# Altium schematic sheet Registers_Module.SchDoc
size A1; SheetNumber: 3; SheetTotal: 9
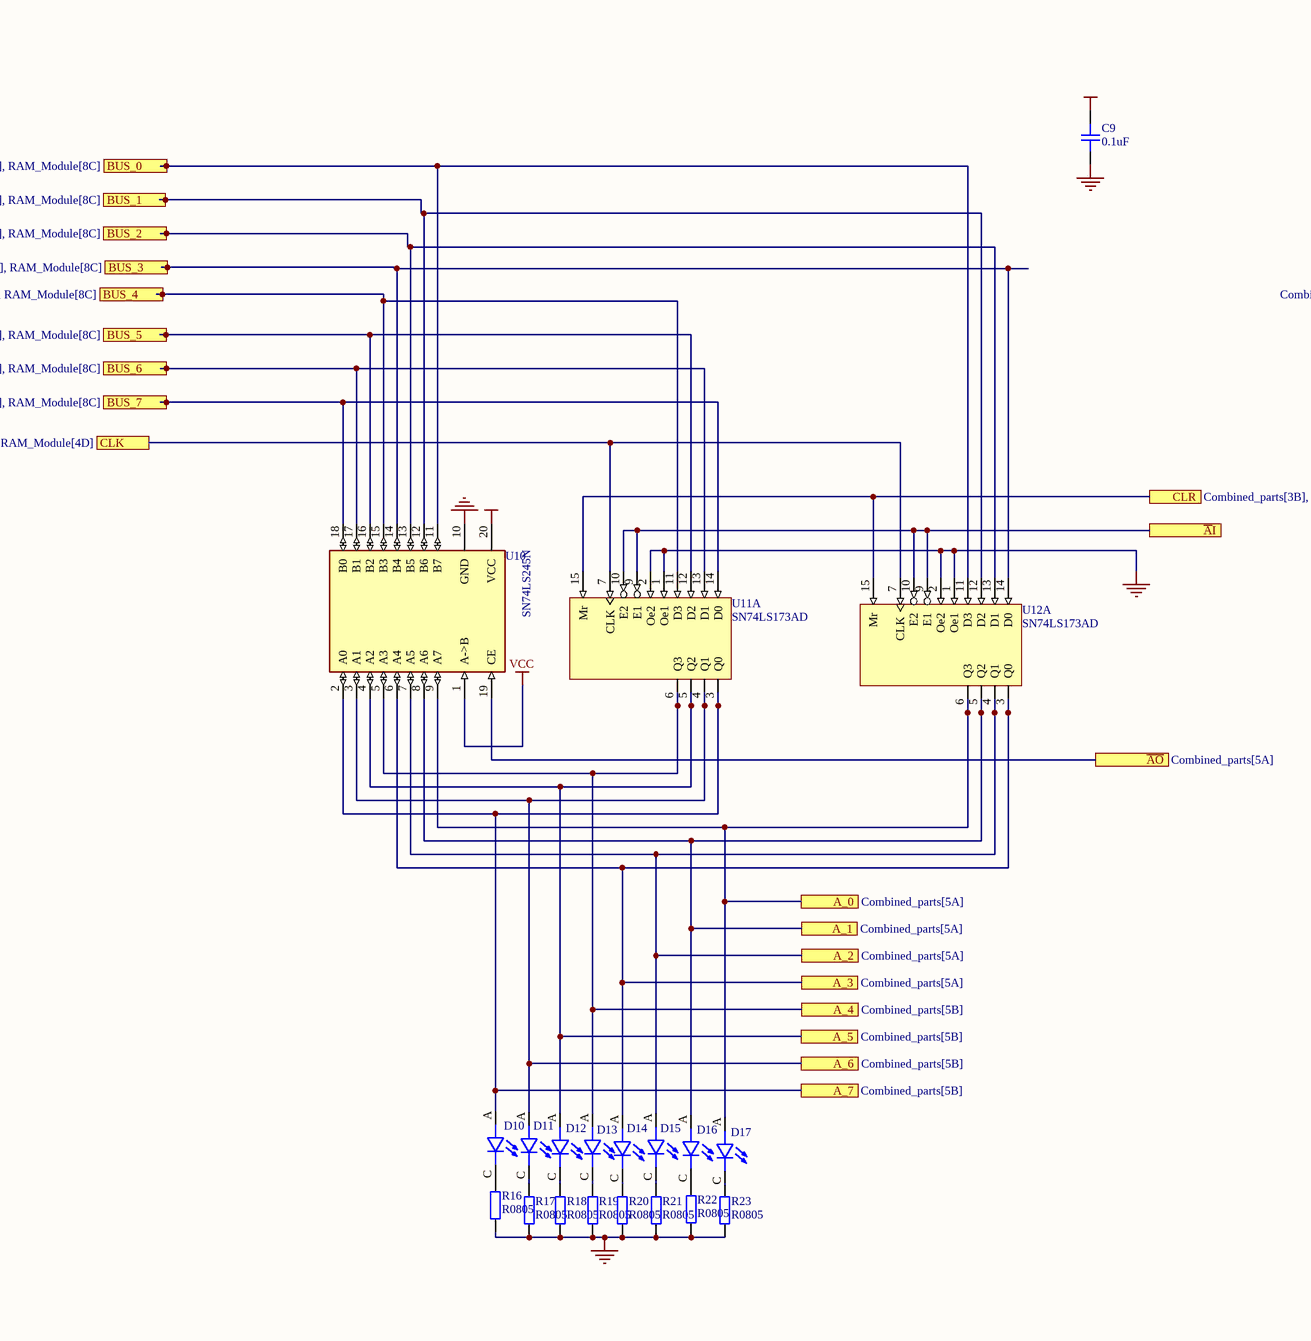
[diagram p0: Registers_Module.SchDoc, top left]
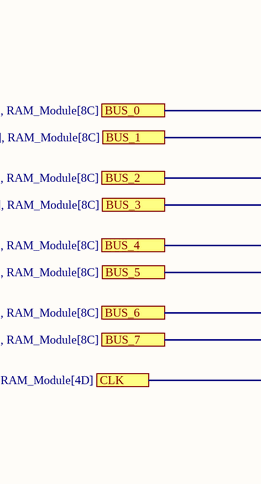
[diagram p1: Registers_Module.SchDoc, top middle]
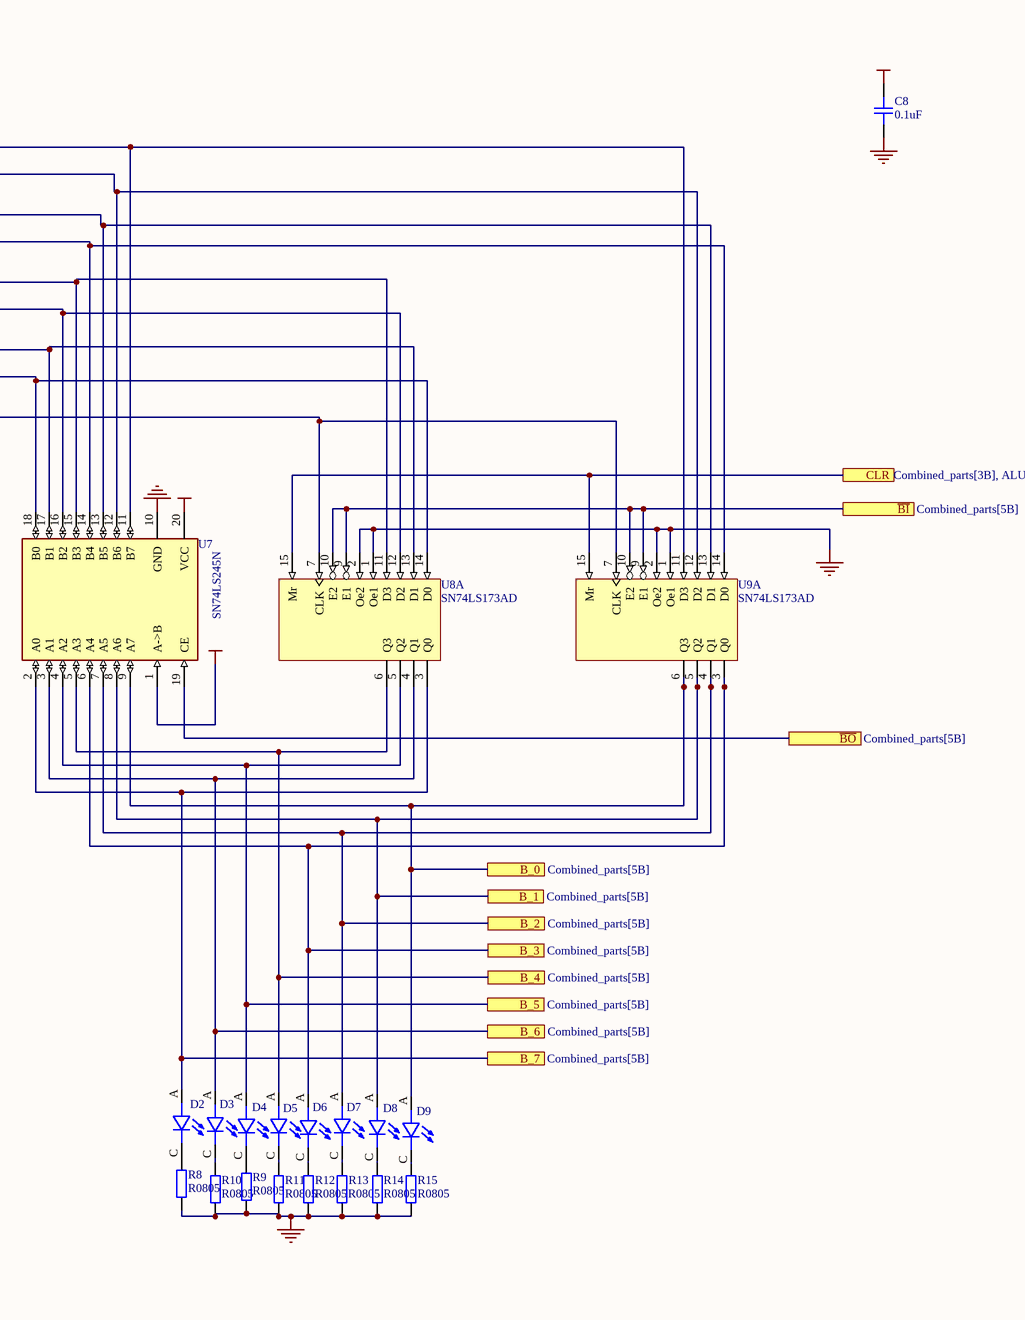
[diagram p2: Registers_Module.SchDoc, top right]
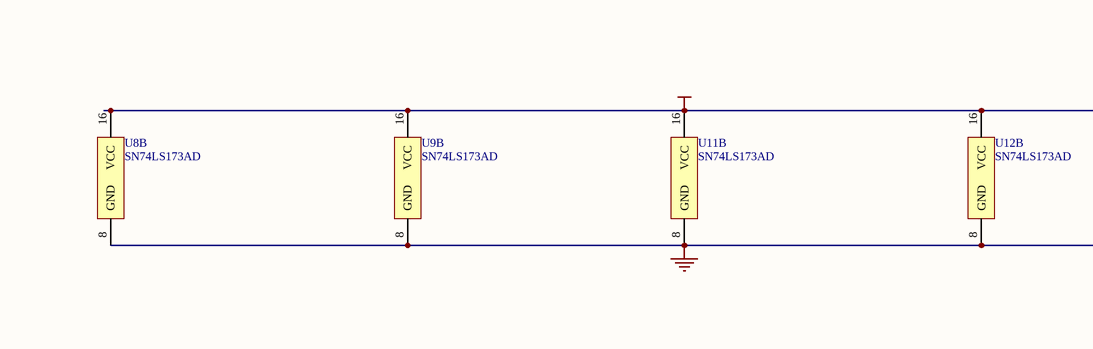
[diagram p3: Registers_Module.SchDoc, bottom left]
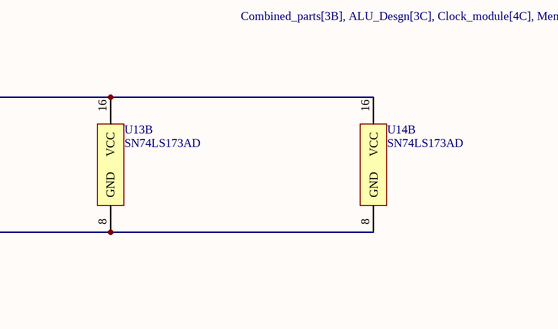
[diagram p4: Registers_Module.SchDoc, bottom middle]
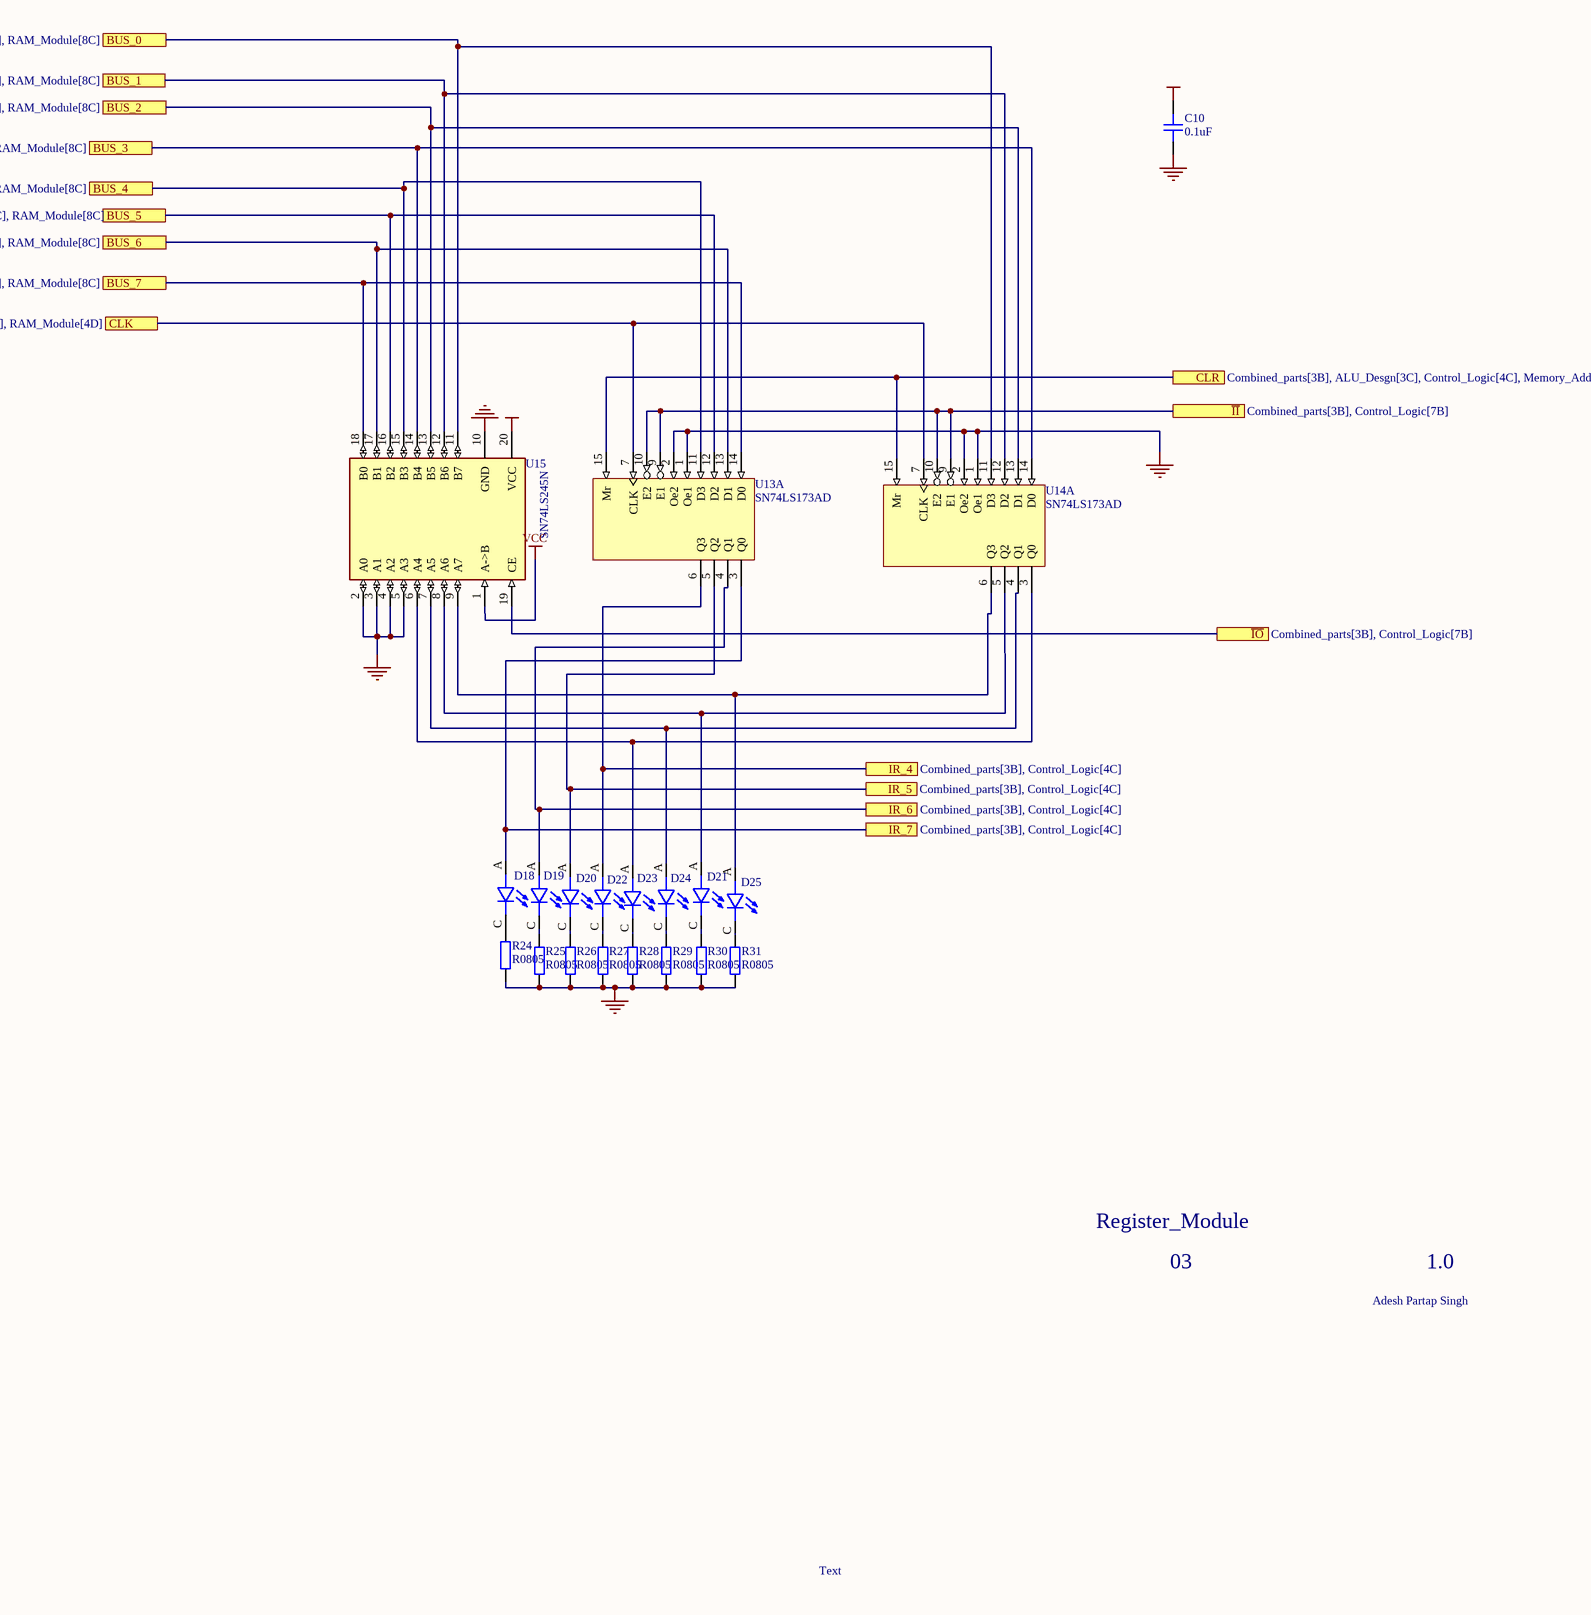
[diagram p5: Registers_Module.SchDoc, bottom right]

## Parts
C8  0.1uF  [CAP_0805]
C9  0.1uF  [CAP_0805]
C10  0.1uF  [CAP_0805]
D2  L08R5000Q1  [LEDRD254W57D500H1070]  (value not drawn)
D3  L08R5000Q1  [LEDRD254W57D500H1070]  (value not drawn)
D4  L08R5000Q1  [LEDRD254W57D500H1070]  (value not drawn)
D5  L08R5000Q1  [LEDRD254W57D500H1070]  (value not drawn)
D6  L08R5000Q1  [LEDRD254W57D500H1070]  (value not drawn)
D7  L08R5000Q1  [LEDRD254W57D500H1070]  (value not drawn)
D8  L08R5000Q1  [LEDRD254W57D500H1070]  (value not drawn)
D9  L08R5000Q1  [LEDRD254W57D500H1070]  (value not drawn)
D10  L08R5000Q1  [LEDRD254W57D500H1070]  (value not drawn)
D11  L08R5000Q1  [LEDRD254W57D500H1070]  (value not drawn)
D12  L08R5000Q1  [LEDRD254W57D500H1070]  (value not drawn)
D13  L08R5000Q1  [LEDRD254W57D500H1070]  (value not drawn)
D14  L08R5000Q1  [LEDRD254W57D500H1070]  (value not drawn)
D15  L08R5000Q1  [LEDRD254W57D500H1070]  (value not drawn)
D16  L08R5000Q1  [LEDRD254W57D500H1070]  (value not drawn)
D17  L08R5000Q1  [LEDRD254W57D500H1070]  (value not drawn)
D18  L08R5000Q1  [LEDRD254W57D500H1070]  (value not drawn)
D19  L08R5000Q1  [LEDRD254W57D500H1070]  (value not drawn)
D20  L08R5000Q1  [LEDRD254W57D500H1070]  (value not drawn)
D21  L08R5000Q1  [LEDRD254W57D500H1070]  (value not drawn)
D22  L08R5000Q1  [LEDRD254W57D500H1070]  (value not drawn)
D23  L08R5000Q1  [LEDRD254W57D500H1070]  (value not drawn)
D24  L08R5000Q1  [LEDRD254W57D500H1070]  (value not drawn)
D25  L08R5000Q1  [LEDRD254W57D500H1070]  (value not drawn)
R8  R0805  [RES_0805]
R9  R0805  [RES_0805]
R10  R0805  [RES_0805]
R11  R0805  [RES_0805]
R12  R0805  [RES_0805]
R13  R0805  [RES_0805]
R14  R0805  [RES_0805]
R15  R0805  [RES_0805]
R16  R0805  [RES_0805]
R17  R0805  [RES_0805]
R18  R0805  [RES_0805]
R19  R0805  [RES_0805]
R20  R0805  [RES_0805]
R21  R0805  [RES_0805]
R22  R0805  [RES_0805]
R23  R0805  [RES_0805]
R24  R0805  [RES_0805]
R25  R0805  [RES_0805]
R26  R0805  [RES_0805]
R27  R0805  [RES_0805]
R28  R0805  [RES_0805]
R29  R0805  [RES_0805]
R30  R0805  [RES_0805]
R31  R0805  [RES_0805]
U7  SN74LS245N  [FP-N0020A-MFG]
U8  SN74LS173AD  [D0016A_N]  (parts A,B of 2)
U9  SN74LS173AD  [D0016A_N]  (parts A,B of 2)
U10  SN74LS245N  [FP-N0020A-MFG]
U11  SN74LS173AD  [D0016A_N]  (parts A,B of 2)
U12  SN74LS173AD  [D0016A_N]  (parts A,B of 2)
U13  SN74LS173AD  [D0016A_N]  (parts A,B of 2)
U14  SN74LS173AD  [D0016A_N]  (parts A,B of 2)
U15  SN74LS245N  [FP-N0020A-MFG]

## Ports
A_0 (see Combined_parts[5A]), A_1 (see Combined_parts[5A]), A_2 (see Combined_parts[5A]), A_3 (see Combined_parts[5A]), A_4 (see Combined_parts[5B]), A_5 (see Combined_parts[5B]), A_6 (see Combined_parts[5B]), A_7 (see Combined_parts[5B]), B_0 (see Combined_parts[5B]), B_1 (see Combined_parts[5B]), B_2 (see Combined_parts[5B]), B_3 (see Combined_parts[5B]), B_4 (see Combined_parts[5B]), B_5 (see Combined_parts[5B]), B_6 (see Combined_parts[5B]), B_7 (see Combined_parts[5B]), BUS_0 (see Combined_parts[3B], ALU_Desgn[4A], Memory_Add_Register[4A], Output_Registers[3C], Program_Counter[3C], RAM_Module[8C]), BUS_1 (see Combined_parts[3B], ALU_Desgn[4A], Memory_Add_Register[4A], Output_Registers[3C], Program_Counter[3C], RAM_Module[8C]), BUS_2 (see Combined_parts[3B], ALU_Desgn[4B], Memory_Add_Register[4A], Output_Registers[3C], Program_Counter[3C], RAM_Module[8C]), BUS_3 (see Combined_parts[3B], ALU_Desgn[4B], Memory_Add_Register[4B], Output_Registers[3C], Program_Counter[3C], RAM_Module[8C]), BUS_4 (see Combined_parts[3B], ALU_Desgn[4B], Output_Registers[3C], RAM_Module[8C]), BUS_5 (see Combined_parts[3B], ALU_Desgn[4B], Output_Registers[3C], RAM_Module[8C]), BUS_6 (see Combined_parts[3B], ALU_Desgn[4B], Output_Registers[3C], RAM_Module[8C]), BUS_7 (see Combined_parts[3B], ALU_Desgn[4B], Output_Registers[3C], RAM_Module[8C]), CLK (see Combined_parts[3B], ALU_Desgn[3C], Clock_module[4C], Memory_Add_Register[3A], Output_Registers[3C], Program_Counter[3C], RAM_Module[4D]), CLR (see Combined_parts[3B], ALU_Desgn[3C], Control_Logic[4C], Memory_Add_Register[3A]), IR_4 (see Combined_parts[3B], Control_Logic[4C]), IR_5 (see Combined_parts[3B], Control_Logic[4C]), IR_6 (see Combined_parts[3B], Control_Logic[4C]), IR_7 (see Combined_parts[3B], Control_Logic[4C]), ~{AO} (see Combined_parts[5A]), ~{A}I, ~{BI} (see Combined_parts[5B]), ~{BO} (see Combined_parts[5B]), ~{II} (see Combined_parts[3B], Control_Logic[7B]), ~{IO} (see Combined_parts[3B], Control_Logic[7B])

## Nets
GND: C8.1 C9.1 C10.1 R8.1 R9.1 R10.1 R11.1 R12.1 R13.1 R14.1 R15.1 R16.1 R17.1 R18.1 R19.1 R20.1 R21.1 R22.1 R23.1 R24.1 R25.1 R26.1 R27.1 R28.1 R29.1 R30.1 R31.1 U7.10(GND) U8.1(Oe1) U8.2(Oe2) U8.8(GND) U9.1(Oe1) U9.2(Oe2) U9.8(GND) U10.10(GND) U11.1(Oe1) U11.2(Oe2) U11.8(GND) U12.1(Oe1) U12.2(Oe2) U12.8(GND) U13.1(Oe1) U13.2(Oe2) U13.8(GND) U14.1(Oe1) U14.2(Oe2) U14.8(GND) U15.2(A0) U15.3(A1) U15.4(A2) U15.5(A3) U15.10(GND)
VCC: C8.2 C9.2 C10.2 U7.1(A->B) U7.20(VCC) U8.16(VCC) U9.16(VCC) U10.1(A->B) U10.20(VCC) U11.16(VCC) U12.16(VCC) U13.16(VCC) U14.16(VCC) U15.1(A->B) U15.20(VCC)
~{A}I: U11.9(E1) U11.10(E2) U12.9(E1) U12.10(E2) ; port ~{A}I
~{AO}: U10.19(CE) ; port ~{AO}
A_0: D17.A U10.9(A7) U12.6(Q3) ; port A_0
A_1: D16.A U10.8(A6) U12.5(Q2) ; port A_1
A_2: D15.A U10.7(A5) U12.4(Q1) ; port A_2
A_3: D14.A U10.6(A4) U12.3(Q0) ; port A_3
A_4: D13.A U10.5(A3) U11.6(Q3) ; port A_4
A_5: D12.A U10.4(A2) U11.5(Q2) ; port A_5
A_6: D11.A U10.3(A1) U11.4(Q1) ; port A_6
A_7: D10.A U10.2(A0) U11.3(Q0) ; port A_7
~{BI}: U8.9(E1) U8.10(E2) U9.9(E1) U9.10(E2) ; port ~{BI}
~{BO}: U7.19(CE) ; port ~{BO}
B_0: D9.A U7.9(A7) U9.6(Q3) ; port B_0
B_1: D8.A U7.8(A6) U9.5(Q2) ; port B_1
B_2: D7.A U7.7(A5) U9.4(Q1) ; port B_2
B_3: D6.A U7.6(A4) U9.3(Q0) ; port B_3
B_4: D5.A U7.5(A3) U8.6(Q3) ; port B_4
B_5: D4.A U7.4(A2) U8.5(Q2) ; port B_5
B_6: D3.A U7.3(A1) U8.4(Q1) ; port B_6
B_7: D2.A U7.2(A0) U8.3(Q0) ; port B_7
BUS_0: U7.11(B7) U9.11(D3) U10.11(B7) U12.11(D3) U14.11(D3) U15.11(B7) ; port BUS_0
BUS_1: U7.12(B6) U9.12(D2) U10.12(B6) U12.12(D2) U14.12(D2) U15.12(B6) ; port BUS_1
BUS_2: U7.13(B5) U9.13(D1) U10.13(B5) U12.13(D1) U14.13(D1) U15.13(B5) ; port BUS_2
BUS_3: U7.14(B4) U9.14(D0) U10.14(B4) U12.14(D0) U14.14(D0) U15.14(B4) ; port BUS_3
BUS_4: U7.15(B3) U8.11(D3) U10.15(B3) U11.11(D3) U13.11(D3) U15.15(B3) ; port BUS_4
BUS_5: U7.16(B2) U8.12(D2) U10.16(B2) U11.12(D2) U13.12(D2) U15.16(B2) ; port BUS_5
BUS_6: U7.17(B1) U8.13(D1) U10.17(B1) U11.13(D1) U13.13(D1) U15.17(B1) ; port BUS_6
BUS_7: U7.18(B0) U8.14(D0) U10.18(B0) U11.14(D0) U13.14(D0) U15.18(B0) ; port BUS_7
CLK: U8.7(CLK) U9.7(CLK) U11.7(CLK) U12.7(CLK) U13.7(CLK) U14.7(CLK) ; port CLK
CLR: U8.15(Mr) U9.15(Mr) U11.15(Mr) U12.15(Mr) U13.15(Mr) U14.15(Mr) ; port CLR
~{II}: U13.9(E1) U13.10(E2) U14.9(E1) U14.10(E2) ; port ~{II}
~{IO}: U15.19(CE) ; port ~{IO}
IR_4: D22.A U13.6(Q3) ; port IR_4
IR_5: D20.A U13.5(Q2) ; port IR_5
IR_6: D19.A U13.4(Q1) ; port IR_6
IR_7: D18.A U13.3(Q0) ; port IR_7
NetD2_C: D2.C R8.2
NetD3_C: D3.C R10.2
NetD4_C: D4.C R9.2
NetD5_C: D5.C R11.2
NetD6_C: D6.C R12.2
NetD7_C: D7.C R13.2
NetD8_C: D8.C R14.2
NetD9_C: D9.C R15.2
NetD10_C: D10.C R16.2
NetD11_C: D11.C R17.2
NetD12_C: D12.C R18.2
NetD13_C: D13.C R19.2
NetD14_C: D14.C R20.2
NetD15_C: D15.C R21.2
NetD16_C: D16.C R22.2
NetD17_C: D17.C R23.2
NetD18_C: D18.C R24.2
NetD19_C: D19.C R25.2
NetD20_C: D20.C R26.2
NetD21_A: D21.A U14.5(Q2) U15.8(A6)
NetD21_C: D21.C R30.2
NetD22_C: D22.C R27.2
NetD23_A: D23.A U14.3(Q0) U15.6(A4)
NetD23_C: D23.C R28.2
NetD24_A: D24.A U14.4(Q1) U15.7(A5)
NetD24_C: D24.C R29.2
NetD25_A: D25.A U14.6(Q3) U15.9(A7)
NetD25_C: D25.C R31.2

## Notes on the sheet
- Register_Module
- 03
- Adesh Partap Singh
- 1.0
- Text

## Library data of the parts
C8-C10 = CAP_0805: Capacitor SMD 0805; Manufacturer: *; Manufacturer Part Number: *; Distributor Link: *; LCSC: *; Rating: *; Dielectric: *
D2-D25 = L08R5000Q1: LED, 5MM, ORANGE; LED / Lamp Size: 5mm / T-1 3/4; LED Colour: Orange; Typ Luminous Intensity: 4.3mcd; Viewing Angle: ...; MF: LED Technology; Value: *; SnapEDA_Link: https://www.snapeda.com/parts/L08R5000Q1/LED+Technology/view-part/?ref=snap; MP: L08R5000Q1; Check_prices: https://www.snapeda.com/parts/L08R5000Q1/LED+Technology/view-part/?ref=eda; Availability: In Stock; Price: None; Package: None
R8-R31 = RES_0805: Resistor SMD 0805; Manufacturer: *; Manufacturer Part Number: *; Distributor Link: *; LCSC: *
U7 U10 U15 = CMP-1620-00419-3: IC TXRX NON-INVERT 5.25V 20DIP; Number of Bits per Element: 8; Polarity: Non-Inverting; Low Level Output Current: 24mA; Propagation Delay: 12ns; Min Supply Voltage: 4.75V; Number of Elements: 1; Quiescent Current: 62mA; Logic Function: Transceiver; Direction: Bidirectional; Operating Supply Voltage: 5V; High Level Output Current: -15mA; Mount: Through Hole; Min Operating Temperature: 0°C; Number of Outputs: 8; Max Operating Temperature: 70°C; Max Supply Voltage: 5.25V; Width: 6.35mm; Number of Pins: 20; RoHS Compliant: Yes; Turn-On Delay Time: 12ns; Termination: Through Hole; Number of Channels: 8; Number of Circuits: 8; Weight: 0.042297oz; Package Quantity: 20; Number of Transceivers: 8; Length: 24.33mm; Height: 4.57mm; REACH SVHC: No SVHC; Contact Plating: Gold; Number of Bits: 8; Lead Free: Lead Free; Case/Package: PDIP; Packaging: Rail/Tube; Radiation Hardening: No
U8 U9 U11-U14 = CMP-1616-00008-3: 4-Bit D-type Registers with 3-State Outputs, D0016A, TUBE; Manufacturer: Texas Instruments; Output Logic: Non-inverted; F @ Nom Voltage(Max)(Mhz): 35; VCC(Max)(V): 5.25; VCC(Min)(V): 4.75; tpd @ Nom Voltage(Max)(ns): 30; 3-State Output: Yes; ICC @ Nom Voltage(Max)(mA): 24; Voltage(Nom)(V): 5; Output Type: TTL; Rating: Catalog; Bits(#): 4; Output: 3S; Technology Family: LS; Schmitt Trigger: No; Output Drive (IOL/IOH)(Max)(mA): 24/-2.6; PackageReference: D0016A; Generic Part Number: SN74LS173A; Input Type: TTL; Operating Temperature Range(C): 0 to 70; DatasheetVersion: SDLS067A; Code_JEDEC: MS-012 variation AC